# Altium project maenso-bms ti.PrjPcb
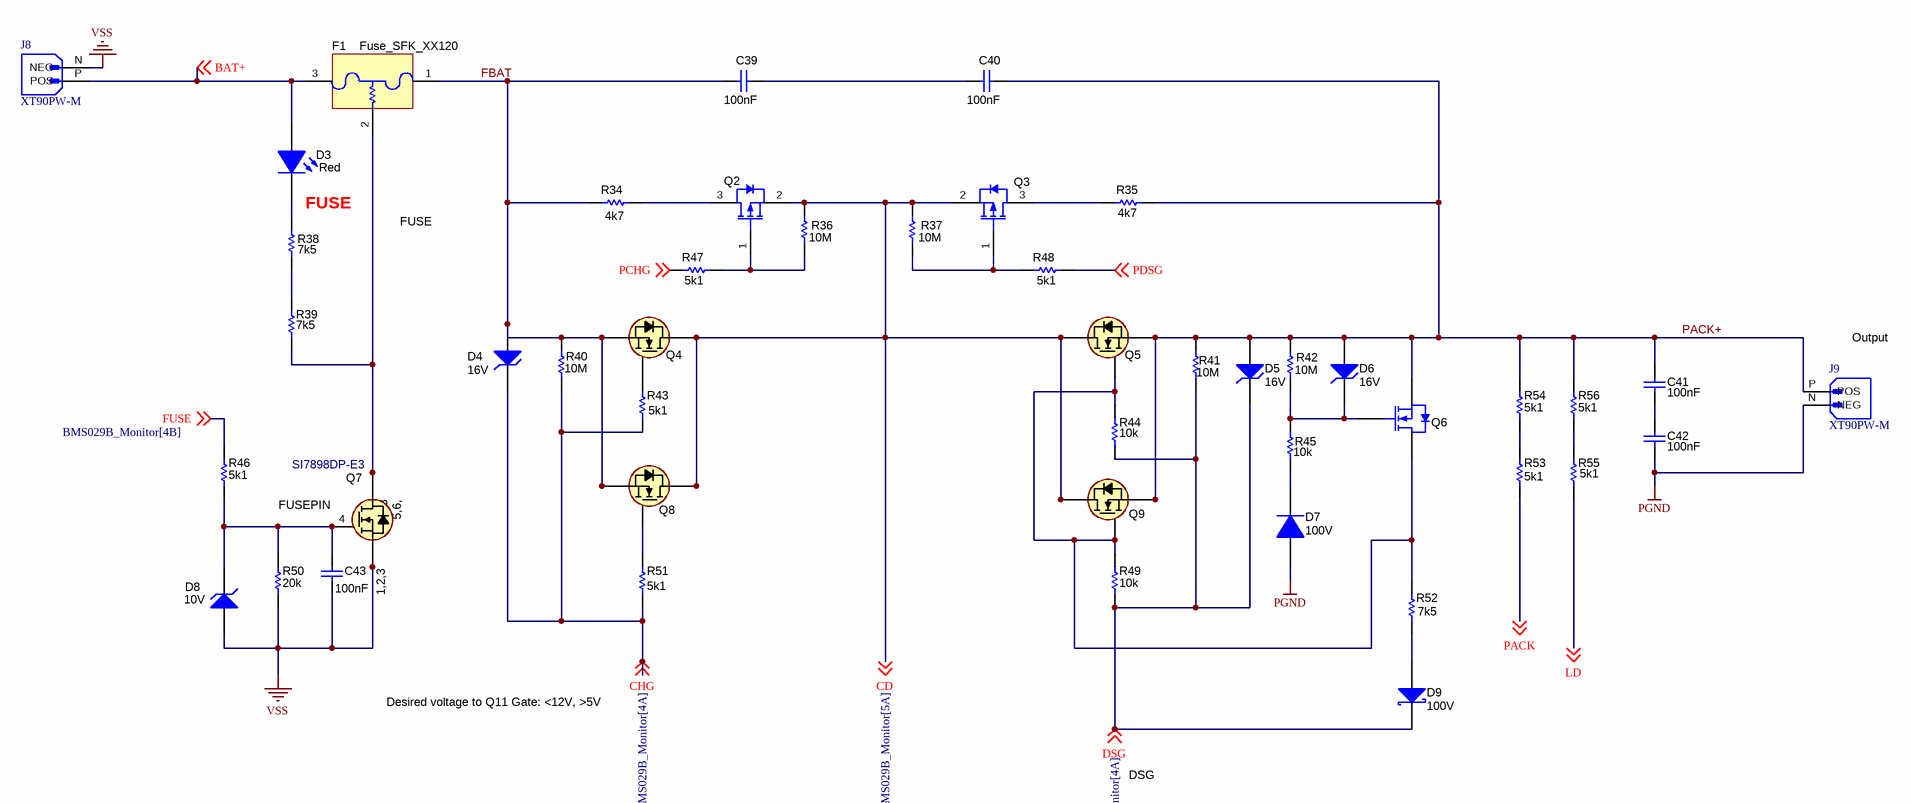
[diagram p0: BMS029B_FETs.SchDoc]
2 sheets, 136 parts. Net scope: global (net labels, ports and power ports of the same name join across sheets).
Board file: PCB1.PcbDoc
Sheets:
  BMS029B_FETs.SchDoc
  BMS029B_Monitor.SchDoc

## Sheet BMS029B_FETs.SchDoc: FETs
size 431 x 279 mm; Date: Not shown in title block; ApprovedBy: Not shown in title block; CheckedBy: Not shown in title block; Author: Not shown in title block; CompanyName: Not shown in title block; DrawnBy: M Sunna; Engineer: Not shown in title block; Organization: Not shown in title block; Address1: Not shown in title block; Address2: Not shown in title block; Address3: Not shown in title block; Address4: Not shown in title block; DocumentNumber: 3; Revision: Use project parameter SCH_Rev; SheetNumber: 1; SheetTotal: 2; PageSetup: Record=PageOptions|CenterHorizontal=True|CenterVertical=True|PrintScale=1.00|XCorrection=1.00|YCorrection=1.00|PrintKind=0|BorderSize=5000000|LeftOffset=0|BottomOffset=0|Orientation=2|PaperLength=1000|PaperWidth=1000|Scale=100|PaperSource=15|PrintQuality=600|MediaType=1|DitherType=10|PaperKind=Letter|PrintScaleMode=1; CurrentTime: Not shown in title block; CurrentDate: Not shown in title block; Time: Not shown in title block; DocumentFullPathAndName: Not shown in title block; DocumentName: Not shown in title block; ModifiedDate: Not shown in title block; ImagePath: Not shown in title block

### Parts
C39  value 100nF  [c0603]  (hidden comment: C1608X7R1H224K080AB)
C40  value 100nF  [c0603]  (hidden comment: C1608X7R1H224K080AB)
C41  value 100nF  [c0603]  (hidden comment: C1608X7R1H224K080AB)
C42  value 100nF  [c0603]  (hidden comment: C1608X7R1H224K080AB)
C43  value 100nF  [c0603]  (hidden comment: C1608X7R1H224K080AB)
D3  value Red  [WL-SMCW_RED]  (hidden comment: LED SMD)
D4  value 16V  [SOD-123]  (hidden comment: MMSZ5246B-7-F)
D5  value 16V  [SOD-123]  (hidden comment: MMSZ5246B-7-F)
D6  value 16V  [SOD-123]  (hidden comment: MMSZ5246B-7-F)
D7  value 100V  [SOD-123]  (hidden comment: 1N4148W-7-F)
D8  value 10V  [SOD-123]  (hidden comment: MMSZ4697T1G)
D9  value 100V  [SOD-123]  (hidden comment: BAT46W-7-F)
F1  Fuse_SFK_XX120  [120 Amperes SFM Series Self Control Protector(SCP)]
J8  XT90PW-M  [AMASS_XT90PW-M]
J9  XT90PW-M  [AMASS_XT90PW-M]
Q2  MOSFET_P_D3G1S2  [SOT-23]  (value not drawn)
Q3  MOSFET_P_D3G1S2  [SOT-23]  (value not drawn)
Q4  BSC160N15NS5ATMA1  [PG-TDSON-8]  (value not drawn)
Q5  BSC160N15NS5ATMA1  [PG-TDSON-8]  (value not drawn)
Q6  2N7002KW  [SOT-323]  (value not drawn)
Q7  SI7898DP-E3  [PowerPAK_SO-8]
Q8  BSC160N15NS5ATMA1  [PG-TDSON-8]  (value not drawn)
Q9  BSC160N15NS5ATMA1  [PG-TDSON-8]  (value not drawn)
R34  4k7  [2512]
R35  4k7  [2512]
R36  10M  [SMD 0805 res]
R37  10M  [SMD 0805 res]
R38  value 7k5  [SMD 0805 res]  (hidden comment: 0805_res)
R39  value 7k5  [SMD 0805 res]  (hidden comment: 0805_res)
R40  10M  [SMD 0805 res]
R41  10M  [SMD 0805 res]
R42  10M  [SMD 0805 res]
R43  value 5k1  [SMD 0805 res]  (hidden comment: 0805_res)
R44  value 10k  [SMD 0805 res]  (hidden comment: Resistor)
R45  value 10k  [SMD 0805 res]  (hidden comment: Resistor)
R46  value 5k1  [SMD 0805 res]  (hidden comment: 0805_res)
R47  value 5k1  [SMD 0805 res]  (hidden comment: 0805_res)
R48  value 5k1  [SMD 0805 res]  (hidden comment: 0805_res)
R49  value 10k  [SMD 0805 res]  (hidden comment: Resistor)
R50  value 20k  [SMD 0805 res]  (hidden comment: 0805_res)
R51  value 5k1  [SMD 0805 res]  (hidden comment: 0805_res)
R52  value 7k5  [0603S]  (hidden comment: Resistor_0603)
R53  value 5k1  [SMD 0805 res]  (hidden comment: 0805_res)
R54  value 5k1  [SMD 0805 res]  (hidden comment: 0805_res)
R55  value 5k1  [SMD 0805 res]  (hidden comment: 0805_res)
R56  value 5k1  [SMD 0805 res]  (hidden comment: 0805_res)

### Nets
PGND: C42.2 D7.2(A) J9.N(NEG)
VSS: C43.1 D8.2(A) J8.N(NEG) Q7.1(S) Q7.2(S) Q7.3(S) R50.2
BAT+: D3.2(A) F1.3(Fuse) J8.P(POS) ; off-sheet BAT+
CD: Q2.2(S) Q3.2(S) Q4.5(D) Q4.6(D) Q4.7(D) Q4.8(D) Q4.9(D) Q5.5(D) Q5.6(D) Q5.7(D) Q5.8(D) Q5.9(D) Q8.5(D) Q8.6(D) Q8.7(D) Q8.8(D) Q8.9(D) Q9.5(D) Q9.6(D) Q9.7(D) Q9.8(D) Q9.9(D) R36.2 R37.2 ; off-sheet CD
CHG: D4.1(K) R40.1 R43.2 R51.2 ; off-sheet CHG
DSG: D5.1(K) D9.1(K) R41.1 R44.2 R49.2 ; off-sheet DSG
FBAT: C39.2 D4.2(A) F1.1(Fuse) Q4.1(S) Q4.2(S) Q4.3(S) Q8.1(S) Q8.2(S) Q8.3(S) R34.1 R40.2
FUSE: R46.1 ; off-sheet FUSE
LD: R55.2 ; off-sheet LD
PACK: R53.2 ; off-sheet PACK
PACK+: C40.1 C41.1 D5.2(A) D6.2(A) J9.P(POS) Q5.1(S) Q5.2(S) Q5.3(S) Q6.2(S) Q9.1(S) Q9.2(S) Q9.3(S) R35.2 R41.2 R42.2 R54.1 R56.1
PCHG: R47.1 ; off-sheet PCHG
PDSG: R48.2 ; off-sheet PDSG
NetC39_1: C39.1 C40.2
NetC41_2: C41.2 C42.1
NetC43_2: C43.2 D8.1(K) Q7.4(G) R46.2 R50.1
NetD3_1: D3.1(K) R38.2
NetD6_1: D6.1(K) Q6.1(G) R42.1 R45.2
NetD7_1: D7.1(K) R45.1
NetD9_2: D9.2(A) R52.2
NetF1_2: F1.2(Heater) Q7.5(D) Q7.6(D) Q7.7(D) Q7.8(D) Q7.9(D) R39.1
NetQ2_1: Q2.1(G) R36.1 R47.2
NetQ2_3: Q2.3(D) R34.2
NetQ3_1: Q3.1(G) R37.1 R48.1
NetQ3_3: Q3.3(D) R35.1
NetQ4_4: Q4.4(G) R43.1
NetQ5_4: Q5.4(G) Q6.3(D) Q9.4(G) R44.1 R49.1 R52.1
NetQ8_4: Q8.4(G) R51.1
NetR38_1: R38.1 R39.2
NetR53_1: R53.1 R54.2
NetR55_1: R55.1 R56.2

### Notes on the sheet
- FUSE
- (near J9) Output
- FUSEPIN
- Desired voltage to Q11 Gate: <12V, >5V
- DSG
- (in symbol SI7898DP-E3) 7,8; 5,6,; 1,2,3

### Library data of the parts
C39 C40 = Capacitor: CAP, CERM, 0.22 uF, 50 V, +/- 10%, X7R, 0603; Manufacturer: TDK; TaMin_C: -55°C; Polarized: N; SizeAreaWB_mm2: 4.68; Value1: 0.021699 ohm; U/M: EA; TaMax_C: 125°C; SizeZ_mm: 1; SizeX_mm: 1.6; SizeY_mm: 0.8; Cap_Case: 0603; Value2: 50V; SizeArea_mm2: 1.28; AEC Category: Q200; ValueDisplayed: 0.22uF; ESR_ohm: 0.021699; IRMS_A: 1.12496A; Supplier Part Number 2: 04X3259; Publisher: Texas Instruments; Supplier 2: Newark; TempCo: X7R; Published: 2008-06-19; RoHS: Y; MountType: SMT; Supplier 1: Digi-Key; PackageReference: 0603; Tolerance_%: 10%; CompType: Capacitor; LatestRevisionDate: 2017-03-09; PartNumber: C1608X7R1H224K080AB; AEC Qualified: N; VDC_V: 50V; ComponentLink1Description: Datasheet link; AEC Grade: N/A; Supplier Part Number 1: 445-7408-1-ND; Technology: Ceramic; ComponentLink1URL: https://product.tdk.com/en/search/capacitor/ceramic/mlcc/info?part_no=C1608X7R1H224K080AB; Supplier 3: Mouser; Supplier Part Number 3: 810-C1608X7R1H224K
C41 C42 = Capacitor: CAP, CERM, 0.22 uF, 50 V, +/- 10%, X7R, 0603; Manufacturer: TDK; TaMin_C: -55°C; Polarized: N; SizeAreaWB_mm2: 4.68; Value1: 0.021699 ohm; U/M: EA; TaMax_C: 125°C; SizeZ_mm: 1; SizeX_mm: 1.6; SizeY_mm: 0.8; Cap_Case: 0603; Value2: 50V; SizeArea_mm2: 1.28; Cap_F: 220nF; AEC Category: Q200; ValueDisplayed: 0.22uF; ESR_ohm: 0.021699; IRMS_A: 1.12496A; Supplier Part Number 2: 04X3259; Publisher: Texas Instruments; Supplier 2: Newark; TempCo: X7R; Published: 2008-06-19; RoHS: Y; MountType: SMT; Supplier 1: Digi-Key; PackageReference: 0603; Tolerance_%: 10%; CompType: Capacitor; LatestRevisionDate: 2017-03-09; PartNumber: C1608X7R1H224K080AB; AEC Qualified: N; VDC_V: 50V; ComponentLink1Description: Datasheet link; AEC Grade: N/A; Supplier Part Number 1: 445-7408-1-ND; Technology: Ceramic; ComponentLink1URL: https://product.tdk.com/en/search/capacitor/ceramic/mlcc/info?part_no=C1608X7R1H224K080AB; Supplier 3: Mouser; Supplier Part Number 3: 810-C1608X7R1H224K
C43 = Capacitor: CAP, CERM, 0.22 uF, 50 V, +/- 10%, X7R, 0603; Manufacturer: TDK; Polarized: N; ValueDisplayed: 0.22uF; U/M: EA; Cap_F: 220nF; ESR_ohm: 0.021699; Value1: 0.021699 ohm; VDC_V: 50V; IRMS_A: 1.12496A; TaMin_C: -55°C; TaMax_C: 125°C; Cap_Case: 0603; SizeArea_mm2: 1.28; SizeAreaWB_mm2: 4.68; SizeX_mm: 1.6; SizeY_mm: 0.8; SizeZ_mm: 1; AEC Category: Q200; CompType: Capacitor; PartNumber: C1608X7R1H224K080AB; PackageReference: 0603; RoHS: Y; Tolerance_%: 10%; Value2: 50V; MountType: SMT; Technology: Ceramic; TempCo: X7R; Published: 2008-06-19; Publisher: Texas Instruments; LatestRevisionDate: 2017-03-09; ComponentLink1Description: Datasheet link; ComponentLink1URL: https://product.tdk.com/en/search/capacitor/ceramic/mlcc/info?part_no=C1608X7R1H224K080AB; Supplier 1: Digi-Key; Supplier Part Number 1: 445-7408-1-ND; Supplier 2: Newark; Supplier Part Number 2: 04X3259; Supplier 3: Mouser; Supplier Part Number 3: 810-C1608X7R1H224K; AEC Qualified: N; AEC Grade: N/A
D3 = CMP-0002947-3: LED, Red, SMD; Manufacturer: Wurth Elektronik; PartNumber: 150060RS75000; Type: AlInGaP; Vf_V: 2V; Io_A: 30mA; Vr_V: 5V; Tjmax_C: 85°C; Power_TotalModule: 72mW; Value1: 0.072W; Angle: 140; CompType: LED; MountType: SMT; RoHS: Y; PackageReference: LED_0603; Value2: 2V; Color: Red; ComponentLink1URL: http://katalog.we-online.de/led/datasheet/150060RS75000.pdf; ComponentLink1Description: Datasheet link
D4 = Zener: Diode, Zener, 16 V, 500 mW, SOD-123; Manufacturer: Diodes Inc.; Power_W: 500mW; SizeAreaWB_mm2: 13.095; Value1: 0.5W; RJA_CperW: 350; SizeZ_mm: 1.35; SizeX_mm: 3.85; SizeY_mm: 1.7; SizeArea_mm2: 6.545; AEC Category: Q101; Vz_V: 16V; RoHS: Y; MountType: SMT; PackageReference: SOD-123; CompType: Zener; PartNumber: MMSZ5246B-7-F; AEC Qualified: ?; ComponentLink1Description: Datasheet link; ComponentLink1URL: http://www.diodes.com/datasheets/ds18010.pdf
D5 D6 = Zener: Diode, Zener, 16 V, 500 mW, SOD-123; Manufacturer: Diodes Inc.; Power_W: 500mW; SizeY_mm: 1.7; Value1: 0.5W; SizeX_mm: 3.85; RJA_CperW: 350; SizeAreaWB_mm2: 13.095; SizeArea_mm2: 6.545; AEC Category: Q101; SizeZ_mm: 1.35; MountType: SMT; Vz_V: 16V; PackageReference: SOD-123; PartNumber: MMSZ5246B-7-F; AEC Qualified: ?; CompType: Zener; ComponentLink1Description: Datasheet link; RoHS: Y; ComponentLink1URL: http://www.diodes.com/datasheets/ds18010.pdf
D7 = CMP-0029001-2: Diode, Ultrafast, 100 V, 0.15 A, SOD-123; Manufacturer: Diodes Inc.; Vf_V: 1.25V; Value1: 0.15A; Io_A: 1.5dA; TJmax_C: 150°C; SizeAreaWB_mm2: 13.095; SizeArea_mm2: 6.545; SizeX_mm: 3.85; SizeY_mm: 1.7; SizeZ_mm: 1.35; AEC Category: Q101; Green_Lifecycle: Active; Green_REACh: Passed; PartNumber: 1N4148W-7-F; PackageReference: SOD-123; CompType: Diode; Value2: 1.25V; Vr_V: 100V; MountType: SMT; Type: Ultrafast; RoHS: Y; ComponentLink1Description: Datasheet link; ComponentLink1URL: http://www.diodes.com/datasheets/ds30086.pdf; AEC Qualified: ?; Green_EU RoHS: Passed; Green_EU RoHS-2: Passed
D8 = Zener: Diode, Zener, 16 V, 500 mW, SOD-123; Manufacturer: Diodes Inc.; PartNumber: MMSZ5246B-7-F; SizeY_mm: 1.7; SizeX_mm: 3.85; RJA_CperW: 350; SizeAreaWB_mm2: 13.095; AEC Category: Q101; Power_W: 500mW; SizeZ_mm: 1.35; Vz_V: 16V; Value1: 0.5W; SizeArea_mm2: 6.545; PackageReference: SOD-123; AEC Qualified: ?; MountType: SMT; RoHS: Y; ComponentLink1Description: Datasheet link; CompType: Zener; ComponentLink1URL: http://www.diodes.com/datasheets/ds18010.pdf
D9 = DIODE_SCHOTTKY: Diode, Schottky, 100 V, 0.15 A, SOD-123; Manufacturer: Diodes Inc.; Io_A: 150mA; SizeArea_mm2: 6.545; SizeX_mm: 3.85; Value2: 0.6V; Value1: 0.15A; AEC Category: Q101; SizeZ_mm: 1.35; SizeY_mm: 1.7; Green_Lifecycle: Active; Green_REACh: Passed; SizeAreaWB_mm2: 13.095; Vf_V: 600mV; ComponentLink1Description: Datasheet link; MountType: SMT; ComponentLink1URL: http://www.diodes.com/datasheets/ds30044.pdf; Vr_V: 100V; PartNumber: BAT46W-7-F; Type: Schottky; AEC Qualified: ?; Green_EU RoHS-2: Passed; Green_EU RoHS: Passed; CompType: Diode; RoHS: Y; PackageReference: SOD-123
F1 = SFM-12120: 120 Amperes SFM Series Self Control Protector(SCP); Manufacturer: Dexerials Corporation; Irating_A: 30A; CompType: Fuse; VDC_V: 62V; Rtyp_Ohm: 1.75m; PartNumber: SFK-3030; PackageReference: 9.5x2x5mm; ComponentLink1Description: Datasheet URL; MountType: SMT; ComponentLink1URL: https://sps16.itg.ti.com/sites/KMS/crossdivteams/altium/docs/ComponentDatasheets/Dexerials_SFK-xx30x.pdf; RoHS: Y
J8 J9 = XT90PW-M: Socket; DC supply; XT90; male; PIN: 2; on PCBs; THT; Colour: yellow; MF: AMASS; SnapEDA_Link: https://www.snapeda.com/parts/XT90PW-M/AMASS/view-part/?ref=snap; Package: Package; Value: *; MP: XT90PW-M; Check_prices: https://www.snapeda.com/parts/XT90PW-M/AMASS/view-part/?ref=eda
Q2 Q3 = MOSFET_P_D3G1S2: MOSFET, P-CH, -150 V, -0.53 A, SOT-23
Q4 Q5 Q8 Q9 = MOSFET_N_D56789G: MOSFET, N-CH, 150 V, 56 A, PG-TDSON-8; Alternate Manufacturer: None; Manufacturer: Infineon Technologies; QgTyp_nC: 19.0; SizeAreaWB_mm2: 55.131; Vgs_V: 20V; Value1: ? ohm; VdsMax_V: 150V; U/M: EA; Value: 150V; IdsMax_A: 56A; SizeZ_mm: 1.12; SizeX_mm: 5.99; SizeY_mm: 4.9; Value2: 19 nC; SizeArea_mm2: 29.351; ChType: N; AEC Category: Q101; ComponentLink1URL: http://www.infineon.com/dgdl/Infineon-BSC160N15NS5-DS-v02_02-EN.pdf?fileId=5546d46253f650570154a055b7215b1b; Supplier Part Number 2: 726-BSC160N15NS5ATM; Publisher: Texas Instruments; Supplier 2: Mouser; Published: 2008-06-19; RoHS: Y; MountType: SMT; Supplier 1: Digi-Key; LatestRevisionNote: Added parts.; PackageReference: PG-TDSON-8; CompType: MOSFET; LatestRevisionDate: 2017-06-05; PartNumber: BSC160N15NS5ATMA1; AEC Qualified: N; ComponentLink1Description: Datasheet link; Supplier Part Number 1: BSC160N15NS5ATMA1-ND
Q6 = CMP-0000774-1: MOSFET, N-CH, 60 V, 0.31 A, SOT-323; Manufacturer: Fairchild Semiconductor; Alternate Manufacturer: None; Value: 60V; U/M: EA; ChType: N; Value1: 1; Rdson45_ohm: 1.6; Vgs_V: 2.1V; IdsMax_A: 3.1dA; SizeAreaWB_mm2: 10.24; SizeArea_mm2: 4.84; SizeX_mm: 2.2; SizeZ_mm: 1.1; AEC Category: Q101; Green_Lifecycle: Active; Green_REACh: Passed; SymbolVersion: 2008-07-28; CompType: MOSFET; PartNumber: 2N7002KW; PackageReference: SOT-323; VdsMax_V: 60V; RoHS: Y; MountType: SMT; Published: 2008-06-19; Publisher: Texas Instruments; LatestRevisionDate: 2017-03-09; LatestRevisionNote: Added parts.; ComponentLink1Description: Datasheet link; ComponentLink1URL: http://www.fairchildsemi.com/ds/2N/2N7002KW.pdf; Supplier 1: Digi-Key; Supplier Part Number 1: 2N7002KWCT-ND; Supplier 2: Mouser; Supplier Part Number 2: 512-2N7002KW; SizeY_mm: 2.2; AEC Qualified: ?; Green_EU RoHS: Passed; Green_EU RoHS-2: Passed
Q7 = SI7898DP-E3: MOSFET, N-CH, 150 V, 13 A, PowerPACK SO-8; Alternate Manufacturer: None; Manufacturer: Infineon Technologies; PartNumber: BSZ900N15NS3 G; QgTyp_nC: 5; SizeAreaWB_mm2: 19.36; Vgs_V: 20V; VdsMax_V: 150V; U/M: EA; Value: 150V; IdsMax_A: 13A; SizeZ_mm: 1.1; SizeX_mm: 3.4; Value2: 5 nC; SizeArea_mm2: 11.56; ChType: N; AEC Category: Q101; ComponentLink1URL: http://www.infineon.com/dgdl/BSZ900N15NS3+Rev2.1_.pdf?folderId=db3a304326623792012669f6bee2224b&fileId=db3a304326623792012669f7decc224c; Supplier Part Number 2: 726-BSZ900N15NS3G; Publisher: Texas Instruments; Supplier 2: Mouser; Published: 2008-06-19; RoHS: Y; MountType: SMT; Supplier 1: Digi-Key; LatestRevisionNote: Added parts.; PackageReference: PG-TSDSON-8; SizeY_mm: 3.4; CompType: MOSFET; LatestRevisionDate: 2017-03-09; AEC Qualified: ?; ComponentLink1Description: Datasheet link; Supplier Part Number 1: BSZ900N15NS3 GCT-ND
R34 R35 = Resistor_2512: RES, 20.0, 1%, 0.25 W, AEC-Q200 Grade 0, 1206; Manufacturer: Vishay-Dale; PartNumber: CRCW120620R0FKEA; Power_W: 250mW; TempCo: 100 ppm/C; Value_Code: 20R0; EIA_Code: E96; Res_ohm: 20; SizeX_mm: 3.2; SizeY_mm: 1.6; SizeZ_mm: 1.35; Value2: 0.25W; SizeArea_mm2: 5.12; AEC Qualified: Y; VDC_V: 200V; AEC Grade: 0; AEC Category: Q200; RoHS: E; Value1: 1%; MountType: SMT; Value: 4k7; Supplier 1: Digi-Key; PackageReference: 1206; Tolerance_%: 1%; CompType: Resistor; ComponentLink1Description: Datasheet link; Supplier Part Number 1: 541-20.0FCT-ND; Technology: Thick Film; ComponentLink1URL: http://www.vishay.com/docs/20035/dcrcwe3.pdf; Supplier 2: Newark; Supplier 3: Mouser; Supplier Part Number 2: 42K4894; Supplier Part Number 3: 71-CRCW1206-20-E3
R36 R37 R41 R42 R45 R46 R50 = Resistor_0805: 0.25 W, AEC-Q200 Grade 0, 0805; PartNumber: CRCW120620R0FKEA; Manufacturer: Vishay-Dale; Res_ohm: 20; Value_Code: 20R0; Tolerance_%: 1%; Power_W: 250mW; Value2: 0.25W; VDC_V: 200V; TempCo: 100 ppm/C; EIA_Code: E96; SizeArea_mm2: 5.12; SizeX_mm: 3.2; SizeY_mm: 1.6; SizeZ_mm: 1.35; AEC Category: Q200; AEC Qualified: Y; AEC Grade: 0; CompType: Resistor; PackageReference: 1206; RoHS: E; Value1: 1%; MountType: SMT; Technology: Thick Film; ComponentLink1Description: Datasheet link; ComponentLink1URL: http://www.vishay.com/docs/20035/dcrcwe3.pdf; Supplier 1: Digi-Key; Supplier Part Number 1: 541-20.0FCT-ND; Supplier 2: Newark; Supplier Part Number 2: 42K4894; Supplier 3: Mouser; Supplier Part Number 3: 71-CRCW1206-20-E3
  R36 R37 R41 R42: Value: 10M
R38 R39 = Resistor_0805: 0.25 W, AEC-Q200 Grade 0, 0805; Manufacturer: Vishay-Dale; PartNumber: CRCW120620R0FKEA; Power_W: 250mW; TempCo: 100 ppm/C; Value_Code: 20R0; Value1: 1%; EIA_Code: E96; Res_ohm: 20; SizeX_mm: 3.2; SizeY_mm: 1.6; SizeZ_mm: 1.35; Value2: 0.25W; SizeArea_mm2: 5.12; AEC Qualified: Y; VDC_V: 200V; AEC Category: Q200; AEC Grade: 0; Supplier Part Number 2: 42K4894; Supplier 2: Newark; Supplier Part Number 3: 71-CRCW1206-20-E3; Supplier 3: Mouser; RoHS: E; MountType: SMT; Supplier 1: Digi-Key; PackageReference: 1206; Tolerance_%: 1%; CompType: Resistor; ComponentLink1Description: Datasheet link; Supplier Part Number 1: 541-20.0FCT-ND; Technology: Thick Film; ComponentLink1URL: http://www.vishay.com/docs/20035/dcrcwe3.pdf
R40 = Resistor_0805: 0.25 W, AEC-Q200 Grade 0, 0805; PartNumber: CRCW120620R0FKEA; Manufacturer: Vishay-Dale; Value: 20.0; Res_ohm: 20; Value_Code: 20R0; Tolerance_%: 1%; Power_W: 250mW; Value2: 0.25W; VDC_V: 200V; TempCo: 100 ppm/C; EIA_Code: E96; SizeArea_mm2: 5.12; SizeX_mm: 3.2; SizeY_mm: 1.6; SizeZ_mm: 1.35; AEC Category: Q200; AEC Qualified: Y; AEC Grade: 0; CompType: Resistor; PackageReference: 1206; RoHS: E; Value1: 1%; MountType: SMT; Technology: Thick Film; ComponentLink1Description: Datasheet link; ComponentLink1URL: http://www.vishay.com/docs/20035/dcrcwe3.pdf; Supplier 1: Digi-Key; Supplier Part Number 1: 541-20.0FCT-ND; Supplier 2: Newark; Supplier Part Number 2: 42K4894; Supplier 3: Mouser; Supplier Part Number 3: 71-CRCW1206-20-E3
R43 R44 R47-R49 R51 R53-R56 = Resistor_0805: 0.25 W, AEC-Q200 Grade 0, 0805; PartNumber: CRCW120620R0FKEA; Manufacturer: Vishay-Dale; Res_ohm: 20; Value_Code: 20R0; Tolerance_%: 1%; Power_W: 250mW; Value2: 0.25W; VDC_V: 200V; TempCo: 100 ppm/C; SizeArea_mm2: 5.12; SizeX_mm: 3.2; SizeY_mm: 1.6; SizeZ_mm: 1.35; EIA_Code: E96; AEC Category: Q200; AEC Qualified: Y; AEC Grade: 0; CompType: Resistor; PackageReference: 1206; RoHS: E; Value1: 1%; MountType: SMT; Technology: Thick Film; ComponentLink1Description: Datasheet link; ComponentLink1URL: http://www.vishay.com/docs/20035/dcrcwe3.pdf; Supplier 1: Digi-Key; Supplier Part Number 1: 541-20.0FCT-ND; Supplier 2: Newark; Supplier Part Number 2: 42K4894; Supplier 3: Mouser; Supplier Part Number 3: 71-CRCW1206-20-E3
R52 = Resistor_0603: RES, 100, 5%, 0.1 W, AEC-Q200 Grade 0, 0603; Manufacturer: Vishay-Dale; PartNumber: CRCW0603100RJNEA; Power_W: 100mW; TempCo: 200 ppm/C; Value_Code: 100R; EIA_Code: E24; Res_ohm: 100; SizeX_mm: 1.6; SizeY_mm: 0.8; SizeZ_mm: 1; Value2: 0.1W; SizeArea_mm2: 1.28; AEC Qualified: Y; VDC_V: 75V; AEC Category: Q200; AEC Grade: 0; U/M: EA; Supplier Part Number 2: 59M6764; Supplier 2: Newark; Supplier Part Number 3: 71-CRCW0603J-100-E3; Supplier 3: Mouser; RoHS: E; Value1: 5%; MountType: SMT; Supplier 1: Digi-Key; PackageReference: 0603; Tolerance_%: 5%; CompType: Resistor; ComponentLink1Description: Datasheet link; Supplier Part Number 1: 541-100GCT-ND; Technology: Thick Film; ComponentLink1URL: http://www.vishay.com/docs/20035/dcrcwe3.pdf; SymbolVersion: 2009-05-29; Published: 2008-06-26; Publisher: Texas Instruments; LatestRevisionDate: 2017-06-13

## Sheet BMS029B_Monitor.SchDoc: Monitor
size 431 x 279 mm; Date: Not shown in title block; ApprovedBy: Not shown in title block; CheckedBy: Not shown in title block; Author: Not shown in title block; CompanyName: Not shown in title block; Engineer: Not shown in title block; Organization: Not shown in title block; Address1: Not shown in title block; Address2: Not shown in title block; Address3: Not shown in title block; Address4: Not shown in title block; DocumentNumber: 1; Revision: Use project parameter SCH_Rev; SheetNumber: 2; SheetTotal: 2; PageSetup: Record=PageOptions|CenterHorizontal=True|CenterVertical=True|PrintScale=1.00|XCorrection=1.00|YCorrection=1.00|PrintKind=0|BorderSize=5000000|LeftOffset=0|BottomOffset=0|Orientation=2|PaperLength=1000|PaperWidth=1000|Scale=100|PaperSource=15|PrintQuality=600|MediaType=1|DitherType=10|PaperKind=Letter|PrintScaleMode=1; CurrentTime: Not shown in title block; CurrentDate: Not shown in title block; Time: Not shown in title block; DocumentFullPathAndName: Not shown in title block; DocumentName: Not shown in title block; ModifiedDate: Not shown in title block; ImagePath: Not shown in title block
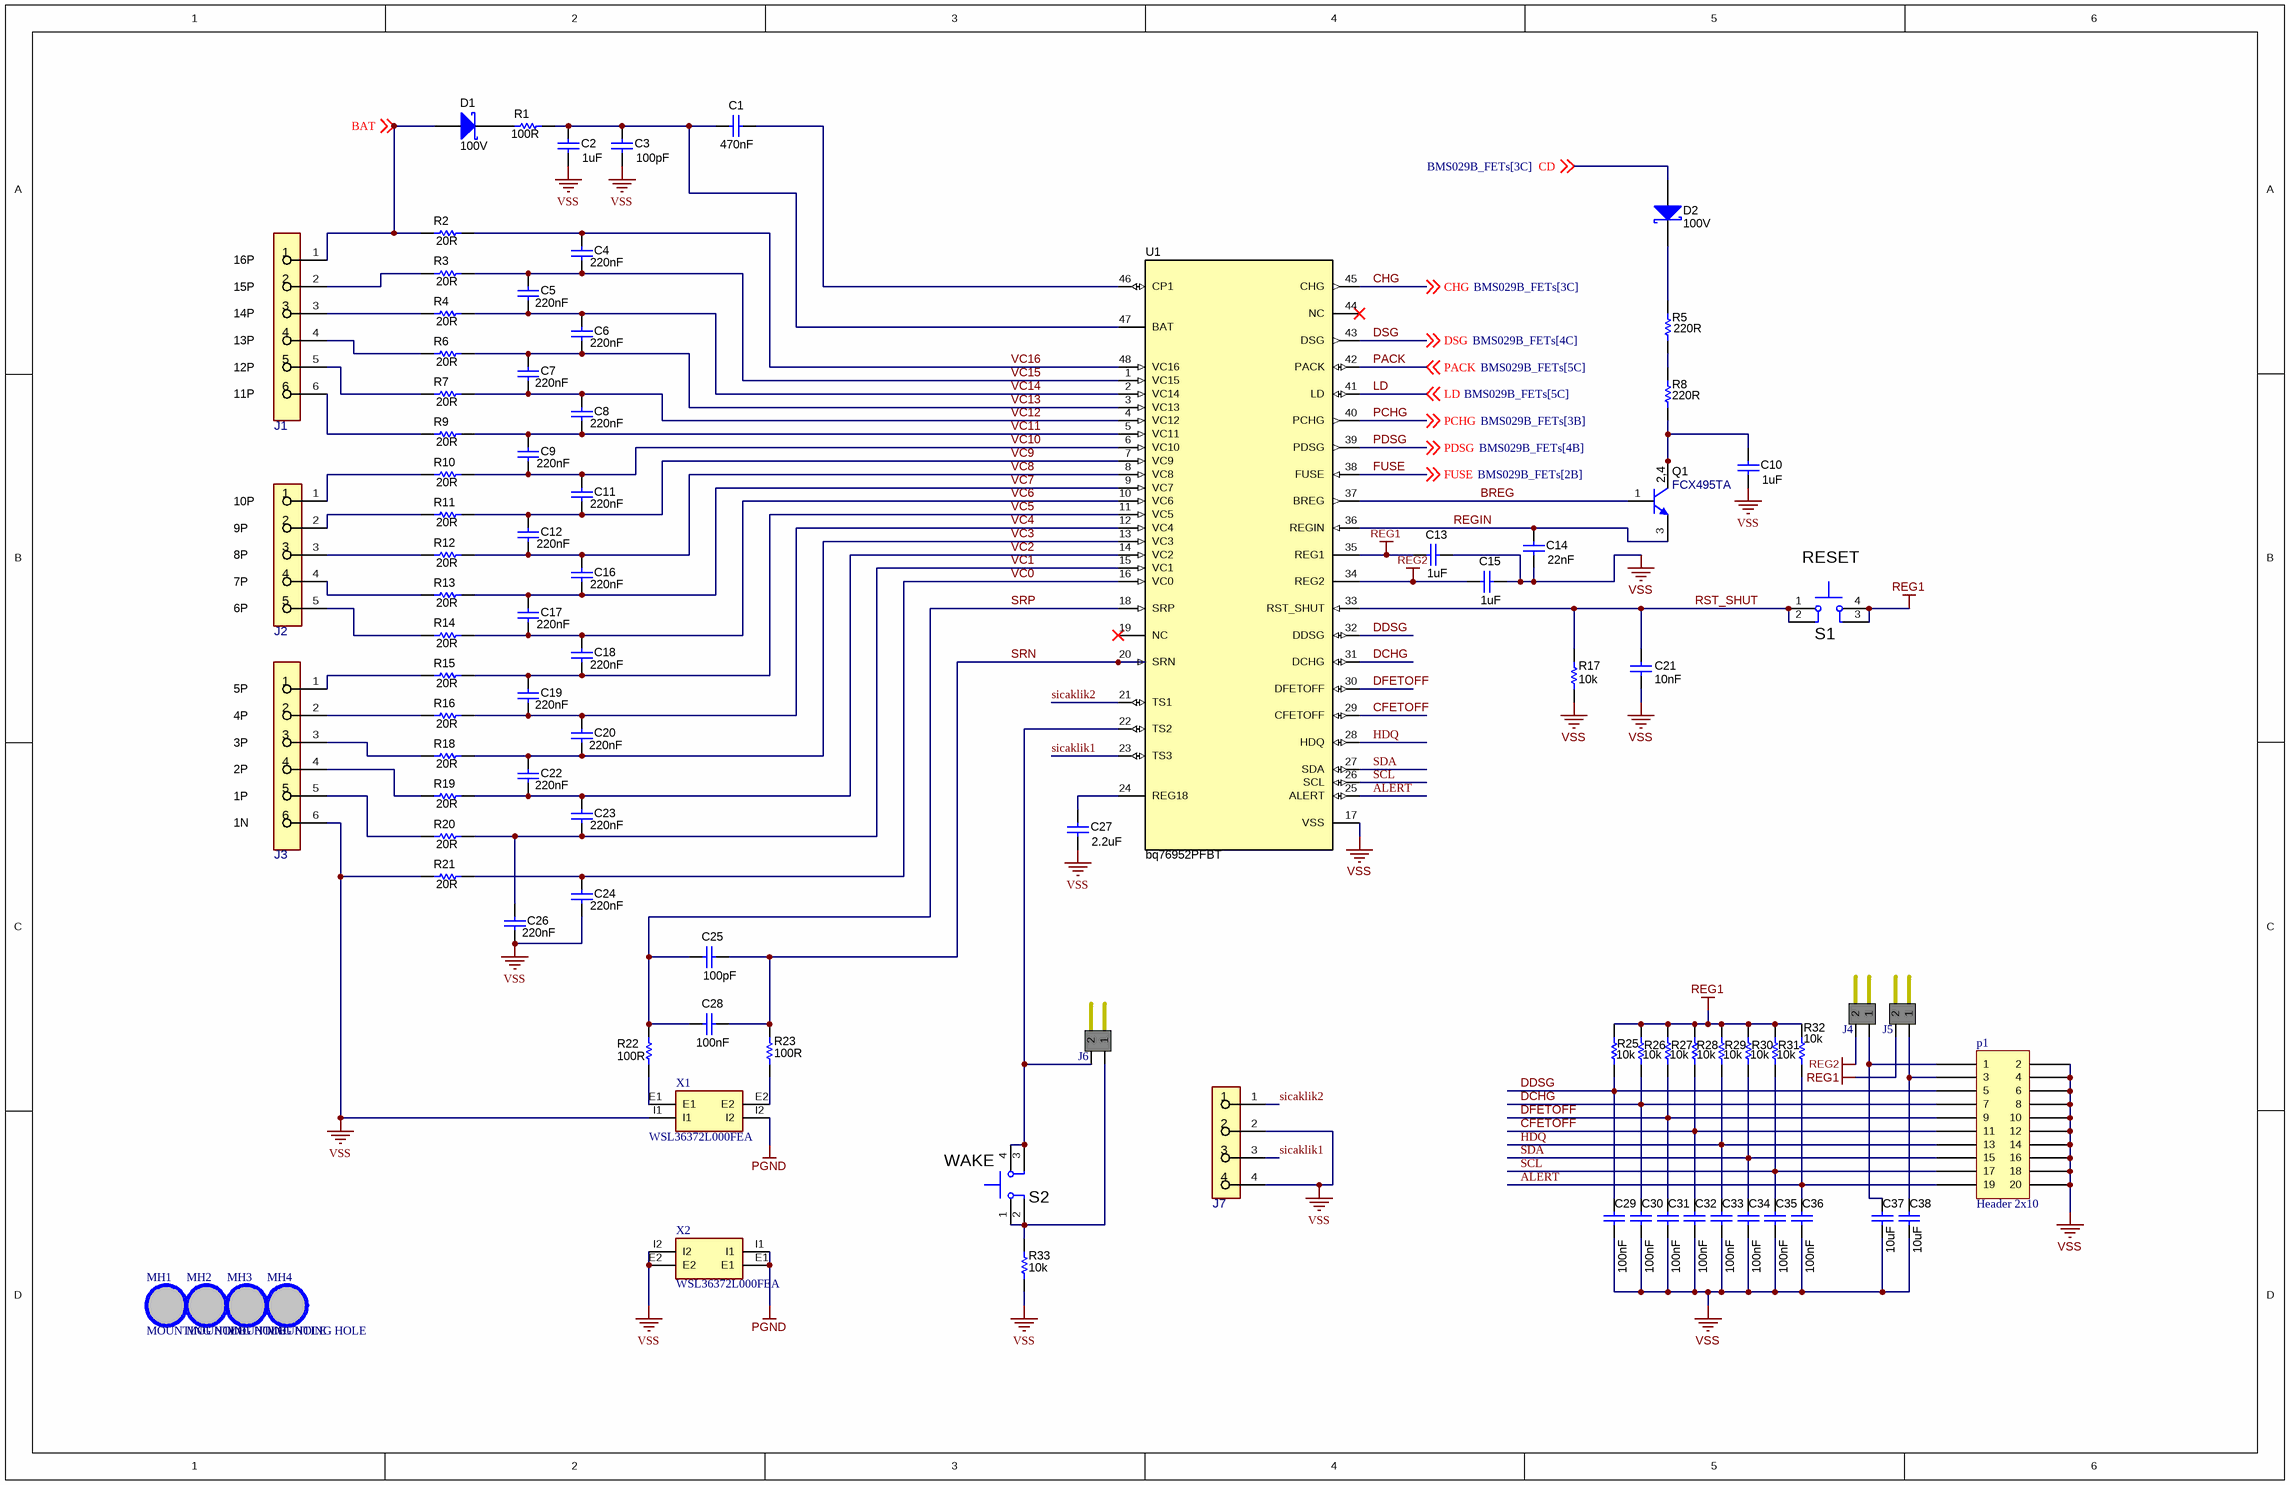
[diagram p1: BMS029B_Monitor.SchDoc]

### Parts
C1  value 470nF  [0805_HV]  (hidden comment: Capacitor_0805)
C2  value 1uF  [1206_180]  (hidden comment: C3216X7R2A105K160AA)
C3  value 100pF  [0805_HV]  (hidden comment: Capacitor_0805)
C4  value 220nF  [c0603]  (hidden comment: C1608X7R1H224K080AB)
C5  value 220nF  [c0603]  (hidden comment: C1608X7R1H224K080AB)
C6  value 220nF  [c0603]  (hidden comment: C1608X7R1H224K080AB)
C7  value 220nF  [c0603]  (hidden comment: C1608X7R1H224K080AB)
C8  value 220nF  [c0603]  (hidden comment: C1608X7R1H224K080AB)
C9  value 220nF  [c0603]  (hidden comment: C1608X7R1H224K080AB)
C10  value 1uF  [1206_180]  (hidden comment: C3216X7R2A105K160AA)
C11  value 220nF  [c0603]  (hidden comment: C1608X7R1H224K080AB)
C12  value 220nF  [c0603]  (hidden comment: C1608X7R1H224K080AB)
C13  value 1uF  [0805_HV]  (hidden comment: Capacitor_0805)
C14  value 22nF  [c0603]  (hidden comment: C1608X7R1H224K080AB)
C15  value 1uF  [0805_HV]  (hidden comment: Capacitor_0805)
C16  value 220nF  [c0603]  (hidden comment: C1608X7R1H224K080AB)
C17  value 220nF  [c0603]  (hidden comment: C1608X7R1H224K080AB)
C18  value 220nF  [c0603]  (hidden comment: C1608X7R1H224K080AB)
C19  value 220nF  [c0603]  (hidden comment: C1608X7R1H224K080AB)
C20  value 220nF  [c0603]  (hidden comment: C1608X7R1H224K080AB)
C21  value 10nF  [0805_HV]  (hidden comment: Capacitor_0805)
C22  value 220nF  [c0603]  (hidden comment: C1608X7R1H224K080AB)
C23  value 220nF  [c0603]  (hidden comment: C1608X7R1H224K080AB)
C24  value 220nF  [c0603]  (hidden comment: C1608X7R1H224K080AB)
C25  value 100pF  [c0603]  (hidden comment: Capacitor_0805)
C26  value 220nF  [c0603]  (hidden comment: C1608X7R1H224K080AB)
C27  value 2.2uF  [0805_HV]  (hidden comment: Capacitor_0805)
C28  value 100nF  [c0603]  (hidden comment: C1608X7R1H224K080AB)
C29  value 100nF  [c0603]  (hidden comment: C1608X7R1H224K080AB)
C30  value 100nF  [c0603]  (hidden comment: C1608X7R1H224K080AB)
C31  value 100nF  [c0603]  (hidden comment: C1608X7R1H224K080AB)
C32  value 100nF  [c0603]  (hidden comment: C1608X7R1H224K080AB)
C33  value 100nF  [c0603]  (hidden comment: C1608X7R1H224K080AB)
C34  value 100nF  [c0603]  (hidden comment: C1608X7R1H224K080AB)
C35  value 100nF  [c0603]  (hidden comment: C1608X7R1H224K080AB)
C36  value 100nF  [c0603]  (hidden comment: C1608X7R1H224K080AB)
C37  value 10uF  [c0603]  (hidden comment: C1608X7R1H224K080AB)
C38  value 10uF  [c0603]  (hidden comment: C1608X7R1H224K080AB)
D1  value 100V  [SOD-123]  (hidden comment: BAT46W-7-F)
D2  value 100V  [SOD-123]  (hidden comment: BAT46W-7-F)
J1  6-Pin JST XH  [6-Pin JST XH - Right Angle Connector Pinheader]  (value not drawn)
J2  5-Pin JST XH  [5-Pin JST XH - Right Angle Connector Pinheader]  (value not drawn)
J3  6-Pin JST XH  [6-Pin JST XH - Right Angle Connector Pinheader]  (value not drawn)
J4  Jumper  [2 pin header]  (value not drawn)
J5  Jumper  [2 pin header]  (value not drawn)
J6  Jumper  [2 pin header]  (value not drawn)
J7  4-Pin JST XH  [4-Pin JST XH - Right Angle Connector Pinheader]  (value not drawn)
MH1  MOUNTING HOLE  [MOUNT-HOLE-M3]  (no BOM)
MH2  MOUNTING HOLE  [MOUNT-HOLE-M3]  (no BOM)
MH3  MOUNTING HOLE  [MOUNT-HOLE-M3]  (no BOM)
MH4  MOUNTING HOLE  [MOUNT-HOLE-M3]  (no BOM)
p1  Header 2x10  [Header 2x10 male rightangle]
Q1  FCX495TA  [SOT-89-3]
R1  value 100R  [SMD 0805 res]  (hidden comment: 0805_res)
R2  value 20R  [2512]  (hidden comment: CRCW120620R0FKEA)
R3  value 20R  [2512]  (hidden comment: CRCW120620R0FKEA)
R4  value 20R  [2512]  (hidden comment: CRCW120620R0FKEA)
R5  value 220R  [2512]  (hidden comment: CRCW120620R0FKEA)
R6  value 20R  [2512]  (hidden comment: CRCW120620R0FKEA)
R7  value 20R  [2512]  (hidden comment: CRCW120620R0FKEA)
R8  value 220R  [2512]  (hidden comment: CRCW120620R0FKEA)
R9  value 20R  [2512]  (hidden comment: CRCW120620R0FKEA)
R10  value 20R  [2512]  (hidden comment: CRCW120620R0FKEA)
R11  value 20R  [2512]  (hidden comment: CRCW120620R0FKEA)
R12  value 20R  [2512]  (hidden comment: CRCW120620R0FKEA)
R13  value 20R  [2512]  (hidden comment: CRCW120620R0FKEA)
R14  value 20R  [2512]  (hidden comment: CRCW120620R0FKEA)
R15  value 20R  [2512]  (hidden comment: CRCW120620R0FKEA)
R16  value 20R  [2512]  (hidden comment: CRCW120620R0FKEA)
R17  value 10k  [SMD 0805 res]  (hidden comment: Resistor)
R18  value 20R  [2512]  (hidden comment: CRCW120620R0FKEA)
R19  value 20R  [2512]  (hidden comment: CRCW120620R0FKEA)
R20  value 20R  [2512]  (hidden comment: CRCW120620R0FKEA)
R21  value 20R  [2512]  (hidden comment: CRCW120620R0FKEA)
R22  value 100R  [0603S]  (hidden comment: Resistor)
R23  value 100R  [0603S]  (hidden comment: Resistor)
R25  value 10k  [SMD 0805 res]  (hidden comment: Resistor)
R26  value 10k  [SMD 0805 res]  (hidden comment: Resistor)
R27  value 10k  [SMD 0805 res]  (hidden comment: Resistor)
R28  value 10k  [SMD 0805 res]  (hidden comment: Resistor)
R29  value 10k  [SMD 0805 res]  (hidden comment: Resistor)
R30  value 10k  [SMD 0805 res]  (hidden comment: Resistor)
R31  value 10k  [SMD 0805 res]  (hidden comment: Resistor)
R32  value 10k  [SMD 0805 res]  (hidden comment: Resistor)
R33  value 10k  [0603S]  (hidden comment: Resistor)
S1  SW_KST221JLFS  [L-KLS7-TS3402-2-5]  (value not drawn)
S2  SW_KST221JLFS  [L-KLS7-TS3402-2-5]  (value not drawn)
U1  bq76952PFBT  [PFB0048A_N]
X1  WSL36372L000FEA  [WSL36372L000FEA]
X2  WSL36372L000FEA  [WSL36372L000FEA]

### Nets
PGND: X1.I2 X2.E1 X2.I1
REG1: C13.2 J5.2 R25.2 R26.2 R27.2 R28.2 R29.2 R30.2 R31.2 R32.1 S1.3 S1.4 U1.35(REG1)
REG2: C15.2 J4.2 U1.34(REG2)
VSS: C2.2 C3.2 C10.2 C13.1 C14.1 C15.1 C21.2 C24.2 C26.2 C27.1 C29.2 C30.2 C31.2 C32.2 C33.2 C34.2 C35.2 C36.2 C37.2 C38.2 J3.6 J7.2 J7.4 p1.2 p1.4 p1.6 p1.8 p1.10 p1.12 p1.14 p1.16 p1.18 p1.20 R17.2 R21.1 R33.2 U1.17(VSS) X1.I1 X2.E2 X2.I2
ALERT: C36.1 p1.19 R32.2 U1.25(ALERT)
BAT: D1.2(A) J1.1 R2.1 ; off-sheet BAT
BREG: Q1.1(B) U1.37(BREG)
CD: D2.2(A) ; off-sheet CD
CFETOFF: C32.1 p1.11 R28.1 U1.29(CFETOFF)
CHG: U1.45(CHG) ; off-sheet CHG
DCHG: C30.1 p1.7 R26.1 U1.31(DCHG)
DDSG: C29.1 p1.5 R25.1 U1.32(DDSG)
DFETOFF: C31.1 p1.9 R27.1 U1.30(DFETOFF)
DSG: U1.43(DSG) ; off-sheet DSG
FUSE: U1.38(FUSE) ; off-sheet FUSE
HDQ: C33.1 p1.13 R29.1 U1.28(HDQ)
LD: U1.41(LD) ; off-sheet LD
PACK: U1.42(PACK) ; off-sheet PACK
PCHG: U1.40(PCHG) ; off-sheet PCHG
PDSG: U1.39(PDSG) ; off-sheet PDSG
REGIN: C14.2 Q1.3(E) U1.36(REGIN)
RST_SHUT: C21.1 R17.1 S1.1 S1.2 U1.33(RST_SHUT)
SCL: C35.1 p1.17 R31.1 U1.26(SCL)
SDA: C34.1 p1.15 R30.1 U1.27(SDA)
sicaklik1: J7.3 U1.23(TS3)
sicaklik2: J7.1 U1.21(TS1)
SRN: C25.1 C28.2 R23.1 U1.20(SRN)
SRP: C25.2 C28.1 R22.1 U1.18(SRP)
VC0: C24.1 R21.2 U1.16(VC0)
VC1: C23.2 C26.1 R20.2 U1.15(VC1)
VC2: C22.2 C23.1 R19.2 U1.14(VC2)
VC3: C20.2 C22.1 R18.2 U1.13(VC3)
VC4: C19.2 C20.1 R16.2 U1.12(VC4)
VC5: C18.2 C19.1 R15.2 U1.11(VC5)
VC6: C17.2 C18.1 R14.2 U1.10(VC6)
VC7: C16.2 C17.1 R13.2 U1.9(VC7)
VC8: C12.2 C16.1 R12.2 U1.8(VC8)
VC9: C11.2 C12.1 R11.2 U1.7(VC9)
VC10: C9.2 C11.1 R10.2 U1.6(VC10)
VC11: C8.2 C9.1 R9.2 U1.5(VC11)
VC12: C7.2 C8.1 R7.2 U1.4(VC12)
VC13: C6.2 C7.1 R6.2 U1.3(VC13)
VC14: C5.2 C6.1 R4.2 U1.2(VC14)
VC15: C4.2 C5.1 R3.2 U1.1(VC15)
VC16: C4.1 R2.2 U1.48(VC16)
NetC1_1: C1.1 C2.1 C3.1 R1.2 U1.47(BAT)
NetC1_2: C1.2 U1.46(CP1)
NetC10_1: C10.1 Q1.2(C) Q1.4(C) R8.1
NetC27_2: C27.2 U1.24(REG18)
NetC37_1: C37.1 J4.1 p1.1
NetC38_1: C38.1 J5.1 p1.3
NetD1_1: D1.1(K) R1.1
NetD2_1: D2.1(K) R5.2
NetJ1_2: J1.2 R3.1
NetJ1_3: J1.3 R4.1
NetJ1_4: J1.4 R6.1
NetJ1_5: J1.5 R7.1
NetJ1_6: J1.6 R9.1
NetJ2_1: J2.1 R10.1
NetJ2_2: J2.2 R11.1
NetJ2_3: J2.3 R12.1
NetJ2_4: J2.4 R13.1
NetJ2_5: J2.5 R14.1
NetJ3_1: J3.1 R15.1
NetJ3_2: J3.2 R16.1
NetJ3_3: J3.3 R18.1
NetJ3_4: J3.4 R19.1
NetJ3_5: J3.5 R20.1
NetJ6_1: J6.1 R33.1 S2.1 S2.2
NetJ6_2: J6.2 S2.3 S2.4 U1.22(TS2)
NetR5_1: R5.1 R8.2
NetR22_2: R22.2 X1.E1
NetR23_2: R23.2 X1.E2

Not connected (* = marked no-connect by the designer): U1 19(NC)* 44(NC)*

### Notes on the sheet
- (near J1) 15P
- (near J1) 16P
- (near J1) 13P
- (near J1) 12P
- (near J1) 14P
- (near J1) 11P
- (near J2) 10P
- 9P
- 8P
- (near S1) RESET
- 6P
- 7P
- 5P
- 2P
- 4P
- 3P
- 1P
- 1N
- (near S2) WAKE
- (in symbol BJT_NPN_C24B1E3) 2,4

### Library data of the parts
C1 C3 C13 C15 C21 = Capacitor_0805: CAP, CERM, * uF, 100 V, +/- 10%, X7R, 0805; Manufacturer: TDK; PartNumber: C3216X7R2A105K160AA; TaMin_C: -55°C; Polarized: N; SizeAreaWB_mm2: 10.92; Value1: 0.004575 ohm; U/M: EA; TaMax_C: 125°C; SizeZ_mm: 1.8; SizeX_mm: 3.2; SizeY_mm: 1.6; Cap_Case: 1206_180; Value2: 100V; SizeArea_mm2: 5.12; Cap_F: 1µF; AEC Category: Q200; ESR_ohm: 4.575m; IRMS_A: 3.39639A; Supplier Part Number 2: 810-C3216X7R2A105K160AA; Publisher: Texas Instruments; Supplier 2: Mouser; TempCo: X7R; Published: 2008-06-19; RoHS: Y; MountType: SMT; Supplier 1: Digi-Key; PackageReference: 1206; Tolerance_%: 10%; CompType: Capacitor; LatestRevisionDate: 2017-03-09; AEC Qualified: N; VDC_V: 100V; ComponentLink1Description: Datasheet link; AEC Grade: N/A; Supplier Part Number 1: 445-4467-1-ND; Technology: Ceramic; ComponentLink1URL: https://product.tdk.com/en/search/capacitor/ceramic/mlcc/info?part_no=C3216X7R2A105K160AA
C2 C10 = Capacitor_1: CAP, CERM, 1 uF, 100 V, +/- 10%, X7R, 1206; Manufacturer: TDK; TaMin_C: -55°C; ESR_ohm: 4.575m; Polarized: N; SizeAreaWB_mm2: 10.92; Value1: 0.004575 ohm; U/M: EA; TaMax_C: 125°C; SizeZ_mm: 1.8; SizeX_mm: 3.2; SizeY_mm: 1.6; Value2: 100V; SizeArea_mm2: 5.12; Cap_F: 1µF; IRMS_A: 3.39639A; AEC Category: Q200; Supplier Part Number 2: 810-C3216X7R2A105K160AA; Publisher: Texas Instruments; Supplier 2: Mouser; TempCo: X7R; Published: 2008-06-19; RoHS: Y; MountType: SMT; Supplier 1: Digi-Key; PackageReference: 1206; Tolerance_%: 10%; Cap_Case: 1206_180; CompType: Capacitor; LatestRevisionDate: 2017-03-09; PartNumber: C3216X7R2A105K160AA; AEC Qualified: N; VDC_V: 100V; ComponentLink1Description: Datasheet link; AEC Grade: N/A; Supplier Part Number 1: 445-4467-1-ND; Technology: Ceramic; ComponentLink1URL: https://product.tdk.com/en/search/capacitor/ceramic/mlcc/info?part_no=C3216X7R2A105K160AA
C4-C9 C11 C12 C16-C20 C22-C24 C26 C29-C38 = Capacitor: CAP, CERM, 0.22 uF, 50 V, +/- 10%, X7R, 0603; Manufacturer: TDK; TaMin_C: -55°C; ESR_ohm: 0.021699; Polarized: N; SizeAreaWB_mm2: 4.68; Value1: 0.021699 ohm; U/M: EA; TaMax_C: 125°C; SizeZ_mm: 1; SizeX_mm: 1.6; SizeY_mm: 0.8; Cap_Case: 0603; Value2: 50V; SizeArea_mm2: 1.28; IRMS_A: 1.12496A; AEC Category: Q200; ValueDisplayed: 0.22uF; Supplier Part Number 2: 04X3259; Publisher: Texas Instruments; Supplier 2: Newark; Supplier Part Number 3: 810-C1608X7R1H224K; TempCo: X7R; Supplier 3: Mouser; Published: 2008-06-19; RoHS: Y; MountType: SMT; Supplier 1: Digi-Key; PackageReference: 0603; Tolerance_%: 10%; CompType: Capacitor; LatestRevisionDate: 2017-03-09; PartNumber: C1608X7R1H224K080AB; AEC Qualified: N; VDC_V: 50V; ComponentLink1Description: Datasheet link; AEC Grade: N/A; Supplier Part Number 1: 445-7408-1-ND; Technology: Ceramic; ComponentLink1URL: https://product.tdk.com/en/search/capacitor/ceramic/mlcc/info?part_no=C1608X7R1H224K080AB
  C29-C36: Cap_F: 100nF
C14 = Capacitor: as C41 on sheet BMS029B_FETs; Supplier Part Number 2: 04X3259; Publisher: Texas Instruments; Supplier 2: Newark; TempCo: X7R; Published: 2008-06-19; RoHS: Y; MountType: SMT; Supplier 1: Digi-Key; PackageReference: 0603; Tolerance_%: 10%; CompType: Capacitor; LatestRevisionDate: 2017-03-09; PartNumber: C1608X7R1H224K080AB; AEC Qualified: N; VDC_V: 50V; ComponentLink1Description: Datasheet link; Supplier Part Number 1: 445-7408-1-ND; Technology: Ceramic; ComponentLink1URL: https://product.tdk.com/en/search/capacitor/ceramic/mlcc/info?part_no=C1608X7R1H224K080AB; AEC Grade: N/A; Supplier 3: Mouser; Supplier Part Number 3: 810-C1608X7R1H224K
C25 = Capacitor: CAP, CERM, 0.22 uF, 50 V, +/- 10%, X7R, 0603; Manufacturer: TDK; PartNumber: C1608X7R1H224K080AB; TaMin_C: -55°C; Polarized: N; SizeAreaWB_mm2: 4.68; Value1: 0.021699 ohm; U/M: EA; TaMax_C: 125°C; SizeZ_mm: 1; SizeX_mm: 1.6; SizeY_mm: 0.8; Cap_Case: 0603; Value2: 50V; SizeArea_mm2: 1.28; Cap_F: 220nF; AEC Category: Q200; ESR_ohm: 0.021699; IRMS_A: 1.12496A; Supplier Part Number 2: 04X3259; Publisher: Texas Instruments; Supplier 2: Newark; Supplier Part Number 3: 810-C1608X7R1H224K; TempCo: X7R; Supplier 3: Mouser; Published: 2008-06-19; RoHS: Y; MountType: SMT; Supplier 1: Digi-Key; PackageReference: 0603; Tolerance_%: 10%; CompType: Capacitor; LatestRevisionDate: 2017-03-09; AEC Qualified: N; VDC_V: 50V; ComponentLink1Description: Datasheet link; Supplier Part Number 1: 445-7408-1-ND; Technology: Ceramic; ComponentLink1URL: https://product.tdk.com/en/search/capacitor/ceramic/mlcc/info?part_no=C1608X7R1H224K080AB; AEC Grade: N/A
C27 = Capacitor_0805: CAP, CERM, * uF, 100 V, +/- 10%, X7R, 0805; Manufacturer: TDK; PartNumber: C3216X7R2A105K160AA; TaMin_C: -55°C; ESR_ohm: 4.575m; Polarized: N; SizeAreaWB_mm2: 10.92; Value1: 0.004575 ohm; U/M: EA; TaMax_C: 125°C; SizeZ_mm: 1.8; SizeX_mm: 3.2; SizeY_mm: 1.6; Cap_Case: 1206_180; Value2: 100V; SizeArea_mm2: 5.12; Cap_F: 1µF; AEC Category: Q200; IRMS_A: 3.39639A; Supplier Part Number 2: 810-C3216X7R2A105K160AA; Publisher: Texas Instruments; Supplier 2: Mouser; TempCo: X7R; Published: 2008-06-19; RoHS: Y; MountType: SMT; Supplier 1: Digi-Key; PackageReference: 1206; Tolerance_%: 10%; CompType: Capacitor; LatestRevisionDate: 2017-03-09; AEC Qualified: N; VDC_V: 100V; ComponentLink1Description: Datasheet link; Supplier Part Number 1: 445-4467-1-ND; Technology: Ceramic; ComponentLink1URL: https://product.tdk.com/en/search/capacitor/ceramic/mlcc/info?part_no=C3216X7R2A105K160AA; AEC Grade: N/A
C28 = Capacitor: CAP, CERM, 0.22 uF, 50 V, +/- 10%, X7R, 0603; Manufacturer: TDK; TaMin_C: -55°C; Polarized: N; SizeAreaWB_mm2: 4.68; Value1: 0.021699 ohm; U/M: EA; TaMax_C: 125°C; SizeZ_mm: 1; SizeX_mm: 1.6; SizeY_mm: 0.8; Cap_Case: 0603; Value2: 50V; SizeArea_mm2: 1.28; Cap_F: 220nF; AEC Category: Q200; ESR_ohm: 0.021699; IRMS_A: 1.12496A; Publisher: Texas Instruments; TempCo: X7R; Published: 2008-06-19; RoHS: Y; MountType: SMT; PackageReference: 0603; Tolerance_%: 10%; CompType: Capacitor; LatestRevisionDate: 2017-03-09; PartNumber: C1608X7R1H224K080AB; AEC Qualified: N; ComponentLink1Description: Datasheet link; AEC Grade: N/A; Technology: Ceramic; ComponentLink1URL: https://product.tdk.com/en/search/capacitor/ceramic/mlcc/info?part_no=C1608X7R1H224K080AB; Supplier 1: Digi-Key; Supplier 2: Newark; Supplier 3: Mouser; Supplier Part Number 1: 445-7408-1-ND; Supplier Part Number 2: 04X3259; Supplier Part Number 3: 810-C1608X7R1H224K; VDC_V: 50V
D1 D2 = DIODE_SCHOTTKY: as D9 on sheet BMS029B_FETs; ComponentLink1Description: Datasheet link; MountType: SMT; ComponentLink1URL: http://www.diodes.com/datasheets/ds30044.pdf; Vr_V: 100V; PartNumber: BAT46W-7-F; Type: Schottky; AEC Qualified: ?; Green_EU RoHS-2: Passed; Green_EU RoHS: Passed; CompType: Diode; RoHS: Y; PackageReference: SOD-123
J1 J3 = 6-Pin JST XH: 6-Pin JST XH - Right Angle Connector Pinheader; Manufacturer: On Shore Technology; PartNumber: OSTTE060161; ContactFinish: Tin; Current_A: 10A; Voltage_V: 300V; Row_Count: 1; Symbol Name: SYM-OSTTE060161; PinCount: 6; RoHS: TRUE; ComponentLink1URL: http://www.on-shore.com/wp-content/uploads/2019/02/OSTTEXX0161.pdf; ComponentLink1Description: Datasheet; PackageReference: HDR6
J2 = 5-Pin JST XH: 5-Pin JST XH - Right Angle Connector Pinheader; Manufacturer: On Shore Technology; PartNumber: OSTTE060161; ContactFinish: Tin; Current_A: 10A; Voltage_V: 300V; Row_Count: 1; Symbol Name: SYM-OSTTE060161; PinCount: 6; RoHS: TRUE; ComponentLink1URL: http://www.on-shore.com/wp-content/uploads/2019/02/OSTTEXX0161.pdf; ComponentLink1Description: Datasheet; PackageReference: HDR6
J4-J6 = Jumper 2
J7 = 4-Pin JST XH: 4-Pin JST XH - Right Angle Connector Pinheader; Manufacturer: On Shore Technology; PartNumber: OSTTE060161; ContactFinish: Tin; Current_A: 10A; Voltage_V: 300V; Row_Count: 1; Symbol Name: SYM-OSTTE060161; PinCount: 6; RoHS: TRUE; ComponentLink1URL: http://www.on-shore.com/wp-content/uploads/2019/02/OSTTEXX0161.pdf; ComponentLink1Description: Datasheet; PackageReference: HDR6
p1 = Header 2x10: Header 2x10 0.254mm
Q1 = BJT_NPN_C24B1E3: Transistor, NPN, 150 V, 1 A, AEC-Q101, SOT-89; Manufacturer: Diodes Inc.; TaMax_C: 150°C; Value2: 300; Value1: 1 A; Vcesat1_V: 200mV; SizeX_mm: 4.1; SizeY_mm: 4.5; TaMin_C: -65°C; IcRated_A: 1A; CompType: BJT; SizeZ_mm: 1.5; AEC Qualified: Y; Value: 150 V; SizeArea_mm2: 18.45; NPN: 1; Vceo_V: 150V; PNP: 0; AEC Category: Q101; SizeAreaWB_mm2: 28.05; U/M: EA; Supplier 2: Newark; Supplier 3: Mouser; Supplier 1: Digi-Key; Supplier Part Number 1: FCX495CT-ND; Supplier Part Number 2: 65T9121; Supplier Part Number 3: 522-FCX495TA; PartNumber: FCX495TA; LatestRevisionDate: 2017-03-09; Publisher: Texas Instruments; ComponentLink1Description: Datasheet link; HfeMax: 300; Published: 2008-07-31; RoHS: Y; PackageReference: SOT-89; MountType: SMT; ComponentLink1URL: https://www.diodes.com/assets/Datasheets/FCX495.pdf
R1 R25-R32 = Resistor_0805: as R36 on sheet BMS029B_FETs; CompType: Resistor; PackageReference: 1206; RoHS: E; Value1: 1%; MountType: SMT; Technology: Thick Film; ComponentLink1Description: Datasheet link; ComponentLink1URL: http://www.vishay.com/docs/20035/dcrcwe3.pdf; Supplier 1: Digi-Key; Supplier Part Number 1: 541-20.0FCT-ND; Supplier 2: Newark; Supplier Part Number 2: 42K4894; Supplier 3: Mouser; Supplier Part Number 3: 71-CRCW1206-20-E3
R2-R4 R6 R7 R9-R16 R18-R21 = Resistor: RES, 20.0, 1%, 0.25 W, AEC-Q200 Grade 0, 1206; Manufacturer: Vishay-Dale; Res_ohm: 20; Value_Code: 20R0; Power_W: 250mW; Value2: 0.25W; VDC_V: 200V; TempCo: 100 ppm/C; EIA_Code: E96; SizeArea_mm2: 5.12; SizeX_mm: 3.2; SizeY_mm: 1.6; SizeZ_mm: 1.35; AEC Category: Q200; AEC Qualified: Y; AEC Grade: 0; CompType: Resistor; PartNumber: CRCW120620R0FKEA; PackageReference: 1206; RoHS: E; Tolerance_%: 1%; Value1: 1%; MountType: SMT; Technology: Thick Film; ComponentLink1Description: Datasheet link; ComponentLink1URL: http://www.vishay.com/docs/20035/dcrcwe3.pdf; Supplier 1: Digi-Key; Supplier Part Number 1: 541-20.0FCT-ND; Supplier 2: Newark; Supplier Part Number 2: 42K4894; Supplier 3: Mouser; Supplier Part Number 3: 71-CRCW1206-20-E3
R5 R8 = Resistor_2512: RES, 20.0, 1%, 0.25 W, AEC-Q200 Grade 0, 1206; Manufacturer: Vishay-Dale; Power_W: 250mW; TempCo: 100 ppm/C; Value_Code: 20R0; EIA_Code: E96; Res_ohm: 20; SizeX_mm: 3.2; SizeY_mm: 1.6; SizeZ_mm: 1.35; Value2: 0.25W; SizeArea_mm2: 5.12; AEC Qualified: Y; VDC_V: 200V; AEC Grade: 0; AEC Category: Q200; RoHS: E; Value1: 1%; MountType: SMT; Supplier 1: Digi-Key; PackageReference: 1206; Tolerance_%: 1%; CompType: Resistor; PartNumber: CRCW120620R0FKEA; ComponentLink1Description: Datasheet link; Supplier Part Number 1: 541-20.0FCT-ND; Technology: Thick Film; ComponentLink1URL: http://www.vishay.com/docs/20035/dcrcwe3.pdf; Supplier 2: Newark; Supplier 3: Mouser; Supplier Part Number 2: 42K4894; Supplier Part Number 3: 71-CRCW1206-20-E3
R17 = Resistor_0805: as R38 on sheet BMS029B_FETs; Supplier Part Number 2: 42K4894; Supplier 2: Newark; Supplier Part Number 3: 71-CRCW1206-20-E3; Supplier 3: Mouser; RoHS: E; MountType: SMT; Supplier 1: Digi-Key; PackageReference: 1206; Tolerance_%: 1%; CompType: Resistor; ComponentLink1Description: Datasheet link; Supplier Part Number 1: 541-20.0FCT-ND; Technology: Thick Film; ComponentLink1URL: http://www.vishay.com/docs/20035/dcrcwe3.pdf
R22 R23 = Resistor_0603: RES, 100, 5%, 0.1 W, AEC-Q200 Grade 0, 0603; PartNumber: CRCW0603100RJNEA; Manufacturer: Vishay-Dale; Res_ohm: 100; Power_W: 100mW; Value2: 0.1W; VDC_V: 75V; TempCo: 200 ppm/C; EIA_Code: E24; U/M: EA; SizeArea_mm2: 1.28; SizeX_mm: 1.6; SizeY_mm: 0.8; SizeZ_mm: 1; AEC Category: Q200; AEC Qualified: Y; AEC Grade: 0; CompType: Resistor; SymbolVersion: 2009-05-29; PackageReference: 0603; RoHS: E; Value_Code: 100R; Tolerance_%: 5%; Value1: 5%; MountType: SMT; Technology: Thick Film; Published: 2008-06-26; Publisher: Texas Instruments; LatestRevisionDate: 2017-06-13; ComponentLink1Description: Datasheet link; ComponentLink1URL: http://www.vishay.com/docs/20035/dcrcwe3.pdf; Supplier 1: Digi-Key; Supplier Part Number 1: 541-100GCT-ND; Supplier 2: Newark; Supplier Part Number 2: 59M6764; Supplier 3: Mouser; Supplier Part Number 3: 71-CRCW0603J-100-E3
R33 = Resistor_0603: RES, 100, 5%, 0.1 W, AEC-Q200 Grade 0, 0603; Manufacturer: Vishay-Dale; PartNumber: CRCW0603100RJNEA; Power_W: 100mW; TempCo: 200 ppm/C; Value_Code: 100R; EIA_Code: E24; Res_ohm: 100; SizeX_mm: 1.6; SizeY_mm: 0.8; SizeZ_mm: 1; Value2: 0.1W; SizeArea_mm2: 1.28; AEC Qualified: Y; VDC_V: 75V; AEC Grade: 0; AEC Category: Q200; U/M: EA; Supplier Part Number 2: 59M6764; Supplier 2: Newark; RoHS: E; Value1: 5%; MountType: SMT; Supplier 1: Digi-Key; PackageReference: 0603; Tolerance_%: 5%; CompType: Resistor; ComponentLink1Description: Datasheet link; Supplier Part Number 1: 541-100GCT-ND; Technology: Thick Film; ComponentLink1URL: http://www.vishay.com/docs/20035/dcrcwe3.pdf; Supplier 3: Mouser; Supplier Part Number 3: 71-CRCW0603J-100-E3; SymbolVersion: 2009-05-29; Published: 2008-06-26; Publisher: Texas Instruments; LatestRevisionDate: 2017-06-13
S1 S2 = SW_KST221JLFS: Switch, Tactile, SPST-NO, SMT; Manufacturer: C&K Components; SymbolCreator: a0799628; VDC_V: 32V; SwitchFunction: Off-Mom; PositionCount: 1; CurrentRating_mA: 50A; Green_Lifecycle: Active; Green_REACh: Passed; SymbolVersion: 2013-06-10; PartNumber: KST221JLFS; MountType: SMT; ComponentLink1Description: Datasheet URL; ComponentLink1URL: http://www.ck-components.com/index.php?module=media&action=Display&cmpref=14404&lang=en&width=&height=&format=&alt=; RoHS: Y; Circuit: SPST-NO; Orientation: Top Actuated; CompType: Switch; PackageReference: Switch, 6.2X5X6.2 mm; Publisher: Texas Instruments; LatestRevisionDate: 2017-03-09; Supplier 1: Digi-Key; Supplier Part Number 1: 401-1848-1-ND; Supplier 2: Mouser; Supplier Part Number 2: 611-KST221JLFS; Green_EU RoHS: Passed; Green_EU RoHS-2: Passed
U1 = bq76952: Multicell Battery Monitor and Protection Family, PFB0048A (TQFP-48); Alternate PartNumber: bq76952PFBR; Alternate Manufacturer: Texas Instruments; SizeAreaWB_mm2: 121; SizeZ_mm: 1.2; SizeX_mm: 9; SizeArea_mm2: 81; CompType: IC; AEC Qualified: N; AEC Category: Q200; ComponentLink1URL: http://www.ti.com/lit/ds/symlink/bq76952.pdf; PackageDescription: TQFP-48; MountType: SMT; ComponentLink2URL: http://www.ti.com/product/bq76952; ComponentLink3Description: Online Datasheet; ComponentLink2Description: Product Folder; Manufacturer: Texas Instruments; ComponentLink3URL: http://www.ti.com/product/bq76952/datasheet; PackageReference: PFB0048A; SizeY_mm: 9; PartNumber: bq76952PFBT; ComponentLink1Description: Datasheet Link
X1 X2 = WSL36372L000FEA: Res Metal Strip 3637 0.002 Ohm 1% 3W +/-75ppm/C Sulfur Resistant Pad SMD Automotive T/R; Manufacturer_Name: Vishay; Geometry.Height: 0.889mm; Manufacturer_Part_Number: WSL36372L000FEA; Mouser Part Number: 71-WSL36372L000FEA; Mouser Price/Stock: https://www.mouser.co.uk/ProductDetail/Vishay-Dale/WSL36372L000FEA?qs=BZd8gNRIy3gZE1V4EKNECw%3D%3D; Arrow Part Number: WSL36372L000FEA; Arrow Price/Stock: https://www.arrow.com/en/products/wsl36372l000fea/vishay?region=nac; Datasheet Link: http://www.vishay.com/docs/30099/wsl3637.pdf

## Nets that join several sheets
PGND: BMS029B_FETs (C42.2 D7.2 J9.N), BMS029B_Monitor (X1.I2 X2.E1 X2.I1)
VSS: BMS029B_FETs (7 pins), BMS029B_Monitor (40 pins)
CD: BMS029B_FETs (24 pins), BMS029B_Monitor (D2.2)
CHG: BMS029B_FETs (D4.1 R40.1 R43.2 R51.2), BMS029B_Monitor (U1.45)
DSG: BMS029B_FETs (5 pins), BMS029B_Monitor (U1.43)
FUSE: BMS029B_FETs (R46.1), BMS029B_Monitor (U1.38)
LD: BMS029B_FETs (R55.2), BMS029B_Monitor (U1.41)
PACK: BMS029B_FETs (R53.2), BMS029B_Monitor (U1.42)
PCHG: BMS029B_FETs (R47.1), BMS029B_Monitor (U1.40)
PDSG: BMS029B_FETs (R48.2), BMS029B_Monitor (U1.39)